# Altium project led-clock.PrjPcb
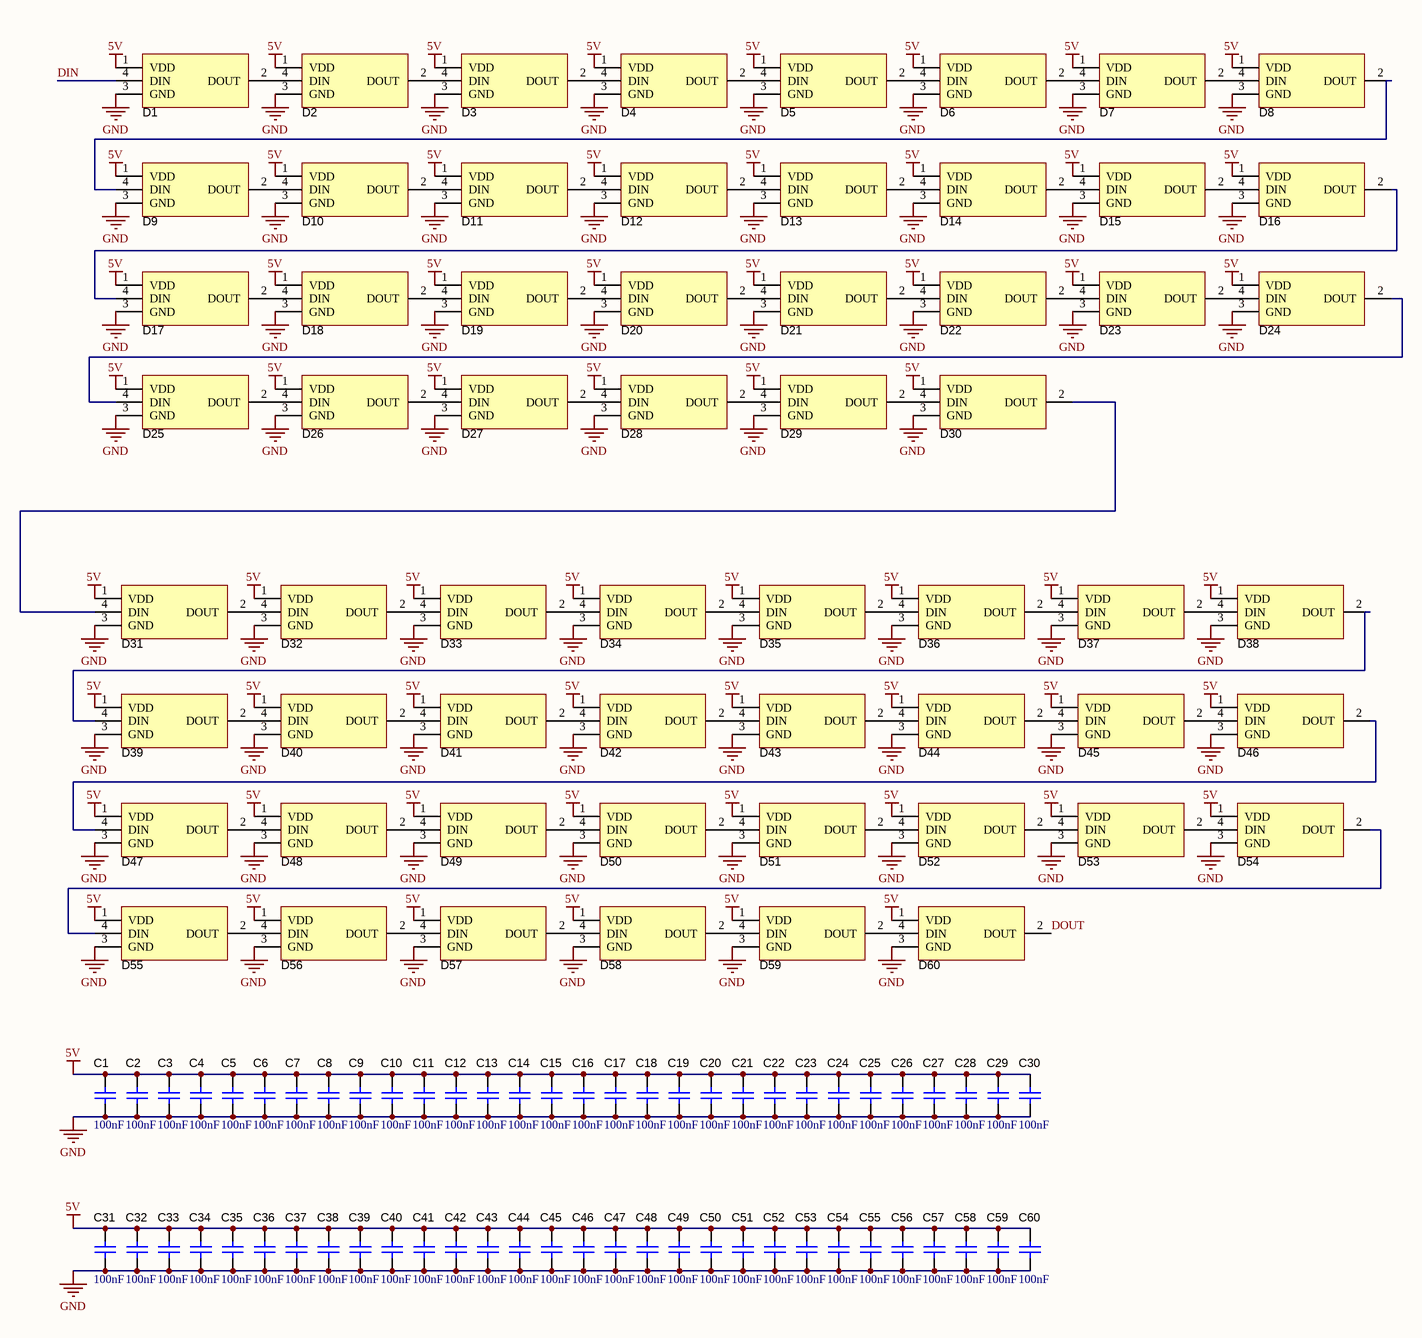
[diagram p0: schematic.SchDoc]
1 sheet, 120 parts. Net scope: global (net labels, ports and power ports of the same name join across sheets).
Board file: pcb.PcbDoc

## Sheet schematic.SchDoc
size A3; SheetNumber: 1; SheetTotal: 1

### Parts
C1  value 100nF  [capacitor 0603]  (hidden comment: passive_5)
C2  value 100nF  [capacitor 0603]  (hidden comment: passive_5)
C3  value 100nF  [capacitor 0603]  (hidden comment: passive_5)
C4  value 100nF  [capacitor 0603]  (hidden comment: passive_5)
C5  value 100nF  [capacitor 0603]  (hidden comment: passive_5)
C6  value 100nF  [capacitor 0603]  (hidden comment: passive_5)
C7  value 100nF  [capacitor 0603]  (hidden comment: passive_5)
C8  value 100nF  [capacitor 0603]  (hidden comment: passive_5)
C9  value 100nF  [capacitor 0603]  (hidden comment: passive_5)
C10  value 100nF  [capacitor 0603]  (hidden comment: passive_5)
C11  value 100nF  [capacitor 0603]  (hidden comment: passive_5)
C12  value 100nF  [capacitor 0603]  (hidden comment: passive_5)
C13  value 100nF  [capacitor 0603]  (hidden comment: passive_5)
C14  value 100nF  [capacitor 0603]  (hidden comment: passive_5)
C15  value 100nF  [capacitor 0603]  (hidden comment: passive_5)
C16  value 100nF  [capacitor 0603]  (hidden comment: passive_5)
C17  value 100nF  [capacitor 0603]  (hidden comment: passive_5)
C18  value 100nF  [capacitor 0603]  (hidden comment: passive_5)
C19  value 100nF  [capacitor 0603]  (hidden comment: passive_5)
C20  value 100nF  [capacitor 0603]  (hidden comment: passive_5)
C21  value 100nF  [capacitor 0603]  (hidden comment: passive_5)
C22  value 100nF  [capacitor 0603]  (hidden comment: passive_5)
C23  value 100nF  [capacitor 0603]  (hidden comment: passive_5)
C24  value 100nF  [capacitor 0603]  (hidden comment: passive_5)
C25  value 100nF  [capacitor 0603]  (hidden comment: passive_5)
C26  value 100nF  [capacitor 0603]  (hidden comment: passive_5)
C27  value 100nF  [capacitor 0603]  (hidden comment: passive_5)
C28  value 100nF  [capacitor 0603]  (hidden comment: passive_5)
C29  value 100nF  [capacitor 0603]  (hidden comment: passive_5)
C30  value 100nF  [capacitor 0603]  (hidden comment: passive_5)
C31  value 100nF  [capacitor 0603]  (hidden comment: passive_5)
C32  value 100nF  [capacitor 0603]  (hidden comment: passive_5)
C33  value 100nF  [capacitor 0603]  (hidden comment: passive_5)
C34  value 100nF  [capacitor 0603]  (hidden comment: passive_5)
C35  value 100nF  [capacitor 0603]  (hidden comment: passive_5)
C36  value 100nF  [capacitor 0603]  (hidden comment: passive_5)
C37  value 100nF  [capacitor 0603]  (hidden comment: passive_5)
C38  value 100nF  [capacitor 0603]  (hidden comment: passive_5)
C39  value 100nF  [capacitor 0603]  (hidden comment: passive_5)
C40  value 100nF  [capacitor 0603]  (hidden comment: passive_5)
C41  value 100nF  [capacitor 0603]  (hidden comment: passive_5)
C42  value 100nF  [capacitor 0603]  (hidden comment: passive_5)
C43  value 100nF  [capacitor 0603]  (hidden comment: passive_5)
C44  value 100nF  [capacitor 0603]  (hidden comment: passive_5)
C45  value 100nF  [capacitor 0603]  (hidden comment: passive_5)
C46  value 100nF  [capacitor 0603]  (hidden comment: passive_5)
C47  value 100nF  [capacitor 0603]  (hidden comment: passive_5)
C48  value 100nF  [capacitor 0603]  (hidden comment: passive_5)
C49  value 100nF  [capacitor 0603]  (hidden comment: passive_5)
C50  value 100nF  [capacitor 0603]  (hidden comment: passive_5)
C51  value 100nF  [capacitor 0603]  (hidden comment: passive_5)
C52  value 100nF  [capacitor 0603]  (hidden comment: passive_5)
C53  value 100nF  [capacitor 0603]  (hidden comment: passive_5)
C54  value 100nF  [capacitor 0603]  (hidden comment: passive_5)
C55  value 100nF  [capacitor 0603]  (hidden comment: passive_5)
C56  value 100nF  [capacitor 0603]  (hidden comment: passive_5)
C57  value 100nF  [capacitor 0603]  (hidden comment: passive_5)
C58  value 100nF  [capacitor 0603]  (hidden comment: passive_5)
C59  value 100nF  [capacitor 0603]  (hidden comment: passive_5)
C60  value 100nF  [capacitor 0603]  (hidden comment: passive_5)
D1  diode_8  [SK6812-E]  (value not drawn)
D2  diode_8  [SK6812-E]  (value not drawn)
D3  diode_8  [SK6812-E]  (value not drawn)
D4  diode_8  [SK6812-E]  (value not drawn)
D5  diode_8  [SK6812-E]  (value not drawn)
D6  diode_8  [SK6812-E]  (value not drawn)
D7  diode_8  [SK6812-E]  (value not drawn)
D8  diode_8  [SK6812-E]  (value not drawn)
D9  diode_8  [SK6812-E]  (value not drawn)
D10  diode_8  [SK6812-E]  (value not drawn)
D11  diode_8  [SK6812-E]  (value not drawn)
D12  diode_8  [SK6812-E]  (value not drawn)
D13  diode_8  [SK6812-E]  (value not drawn)
D14  diode_8  [SK6812-E]  (value not drawn)
D15  diode_8  [SK6812-E]  (value not drawn)
D16  diode_8  [SK6812-E]  (value not drawn)
D17  diode_8  [SK6812-E]  (value not drawn)
D18  diode_8  [SK6812-E]  (value not drawn)
D19  diode_8  [SK6812-E]  (value not drawn)
D20  diode_8  [SK6812-E]  (value not drawn)
D21  diode_8  [SK6812-E]  (value not drawn)
D22  diode_8  [SK6812-E]  (value not drawn)
D23  diode_8  [SK6812-E]  (value not drawn)
D24  diode_8  [SK6812-E]  (value not drawn)
D25  diode_8  [SK6812-E]  (value not drawn)
D26  diode_8  [SK6812-E]  (value not drawn)
D27  diode_8  [SK6812-E]  (value not drawn)
D28  diode_8  [SK6812-E]  (value not drawn)
D29  diode_8  [SK6812-E]  (value not drawn)
D30  diode_8  [SK6812-E]  (value not drawn)
D31  diode_8  [SK6812-E]  (value not drawn)
D32  diode_8  [SK6812-E]  (value not drawn)
D33  diode_8  [SK6812-E]  (value not drawn)
D34  diode_8  [SK6812-E]  (value not drawn)
D35  diode_8  [SK6812-E]  (value not drawn)
D36  diode_8  [SK6812-E]  (value not drawn)
D37  diode_8  [SK6812-E]  (value not drawn)
D38  diode_8  [SK6812-E]  (value not drawn)
D39  diode_8  [SK6812-E]  (value not drawn)
D40  diode_8  [SK6812-E]  (value not drawn)
D41  diode_8  [SK6812-E]  (value not drawn)
D42  diode_8  [SK6812-E]  (value not drawn)
D43  diode_8  [SK6812-E]  (value not drawn)
D44  diode_8  [SK6812-E]  (value not drawn)
D45  diode_8  [SK6812-E]  (value not drawn)
D46  diode_8  [SK6812-E]  (value not drawn)
D47  diode_8  [SK6812-E]  (value not drawn)
D48  diode_8  [SK6812-E]  (value not drawn)
D49  diode_8  [SK6812-E]  (value not drawn)
D50  diode_8  [SK6812-E]  (value not drawn)
D51  diode_8  [SK6812-E]  (value not drawn)
D52  diode_8  [SK6812-E]  (value not drawn)
D53  diode_8  [SK6812-E]  (value not drawn)
D54  diode_8  [SK6812-E]  (value not drawn)
D55  diode_8  [SK6812-E]  (value not drawn)
D56  diode_8  [SK6812-E]  (value not drawn)
D57  diode_8  [SK6812-E]  (value not drawn)
D58  diode_8  [SK6812-E]  (value not drawn)
D59  diode_8  [SK6812-E]  (value not drawn)
D60  diode_8  [SK6812-E]  (value not drawn)

### Nets
5V: C1.2 C2.2 C3.2 C4.2 C5.2 C6.2 C7.2 C8.2 C9.2 C10.2 C11.2 C12.2 C13.2 C14.2 C15.2 C16.2 C17.2 C18.2 C19.2 C20.2 C21.2 C22.2 C23.2 C24.2 C25.2 C26.2 C27.2 C28.2 C29.2 C30.2 C31.2 C32.2 C33.2 C34.2 C35.2 C36.2 C37.2 C38.2 C39.2 C40.2 C41.2 C42.2 C43.2 C44.2 C45.2 C46.2 C47.2 C48.2 C49.2 C50.2 C51.2 C52.2 C53.2 C54.2 C55.2 C56.2 C57.2 C58.2 C59.2 C60.2 D1.1(VDD) D2.1(VDD) D3.1(VDD) D4.1(VDD) D5.1(VDD) D6.1(VDD) D7.1(VDD) D8.1(VDD) D9.1(VDD) D10.1(VDD) D11.1(VDD) D12.1(VDD) D13.1(VDD) D14.1(VDD) D15.1(VDD) D16.1(VDD) D17.1(VDD) D18.1(VDD) D19.1(VDD) D20.1(VDD) D21.1(VDD) D22.1(VDD) D23.1(VDD) D24.1(VDD) D25.1(VDD) D26.1(VDD) D27.1(VDD) D28.1(VDD) D29.1(VDD) D30.1(VDD) D31.1(VDD) D32.1(VDD) D33.1(VDD) D34.1(VDD) D35.1(VDD) D36.1(VDD) D37.1(VDD) D38.1(VDD) D39.1(VDD) D40.1(VDD) D41.1(VDD) D42.1(VDD) D43.1(VDD) D44.1(VDD) D45.1(VDD) D46.1(VDD) D47.1(VDD) D48.1(VDD) D49.1(VDD) D50.1(VDD) D51.1(VDD) D52.1(VDD) D53.1(VDD) D54.1(VDD) D55.1(VDD) D56.1(VDD) D57.1(VDD) D58.1(VDD) D59.1(VDD) D60.1(VDD)
GND: C1.1 C2.1 C3.1 C4.1 C5.1 C6.1 C7.1 C8.1 C9.1 C10.1 C11.1 C12.1 C13.1 C14.1 C15.1 C16.1 C17.1 C18.1 C19.1 C20.1 C21.1 C22.1 C23.1 C24.1 C25.1 C26.1 C27.1 C28.1 C29.1 C30.1 C31.1 C32.1 C33.1 C34.1 C35.1 C36.1 C37.1 C38.1 C39.1 C40.1 C41.1 C42.1 C43.1 C44.1 C45.1 C46.1 C47.1 C48.1 C49.1 C50.1 C51.1 C52.1 C53.1 C54.1 C55.1 C56.1 C57.1 C58.1 C59.1 C60.1 D1.3(GND) D2.3(GND) D3.3(GND) D4.3(GND) D5.3(GND) D6.3(GND) D7.3(GND) D8.3(GND) D9.3(GND) D10.3(GND) D11.3(GND) D12.3(GND) D13.3(GND) D14.3(GND) D15.3(GND) D16.3(GND) D17.3(GND) D18.3(GND) D19.3(GND) D20.3(GND) D21.3(GND) D22.3(GND) D23.3(GND) D24.3(GND) D25.3(GND) D26.3(GND) D27.3(GND) D28.3(GND) D29.3(GND) D30.3(GND) D31.3(GND) D32.3(GND) D33.3(GND) D34.3(GND) D35.3(GND) D36.3(GND) D37.3(GND) D38.3(GND) D39.3(GND) D40.3(GND) D41.3(GND) D42.3(GND) D43.3(GND) D44.3(GND) D45.3(GND) D46.3(GND) D47.3(GND) D48.3(GND) D49.3(GND) D50.3(GND) D51.3(GND) D52.3(GND) D53.3(GND) D54.3(GND) D55.3(GND) D56.3(GND) D57.3(GND) D58.3(GND) D59.3(GND) D60.3(GND)
DIN: D1.4(DIN)
DOUT: D60.2(DOUT)
NetD1_2: D1.2(DOUT) D2.4(DIN)
NetD2_2: D2.2(DOUT) D3.4(DIN)
NetD3_2: D3.2(DOUT) D4.4(DIN)
NetD4_2: D4.2(DOUT) D5.4(DIN)
NetD5_2: D5.2(DOUT) D6.4(DIN)
NetD6_2: D6.2(DOUT) D7.4(DIN)
NetD7_2: D7.2(DOUT) D8.4(DIN)
NetD8_2: D8.2(DOUT) D9.4(DIN)
NetD9_2: D9.2(DOUT) D10.4(DIN)
NetD10_2: D10.2(DOUT) D11.4(DIN)
NetD11_2: D11.2(DOUT) D12.4(DIN)
NetD12_2: D12.2(DOUT) D13.4(DIN)
NetD13_2: D13.2(DOUT) D14.4(DIN)
NetD14_2: D14.2(DOUT) D15.4(DIN)
NetD15_2: D15.2(DOUT) D16.4(DIN)
NetD16_2: D16.2(DOUT) D17.4(DIN)
NetD17_2: D17.2(DOUT) D18.4(DIN)
NetD18_2: D18.2(DOUT) D19.4(DIN)
NetD19_2: D19.2(DOUT) D20.4(DIN)
NetD20_2: D20.2(DOUT) D21.4(DIN)
NetD21_2: D21.2(DOUT) D22.4(DIN)
NetD22_2: D22.2(DOUT) D23.4(DIN)
NetD23_2: D23.2(DOUT) D24.4(DIN)
NetD24_2: D24.2(DOUT) D25.4(DIN)
NetD25_2: D25.2(DOUT) D26.4(DIN)
NetD26_2: D26.2(DOUT) D27.4(DIN)
NetD27_2: D27.2(DOUT) D28.4(DIN)
NetD28_2: D28.2(DOUT) D29.4(DIN)
NetD29_2: D29.2(DOUT) D30.4(DIN)
NetD30_2: D30.2(DOUT) D31.4(DIN)
NetD31_2: D31.2(DOUT) D32.4(DIN)
NetD32_2: D32.2(DOUT) D33.4(DIN)
NetD33_2: D33.2(DOUT) D34.4(DIN)
NetD34_2: D34.2(DOUT) D35.4(DIN)
NetD35_2: D35.2(DOUT) D36.4(DIN)
NetD36_2: D36.2(DOUT) D37.4(DIN)
NetD37_2: D37.2(DOUT) D38.4(DIN)
NetD38_2: D38.2(DOUT) D39.4(DIN)
NetD39_2: D39.2(DOUT) D40.4(DIN)
NetD40_2: D40.2(DOUT) D41.4(DIN)
NetD41_2: D41.2(DOUT) D42.4(DIN)
NetD42_2: D42.2(DOUT) D43.4(DIN)
NetD43_2: D43.2(DOUT) D44.4(DIN)
NetD44_2: D44.2(DOUT) D45.4(DIN)
NetD45_2: D45.2(DOUT) D46.4(DIN)
NetD46_2: D46.2(DOUT) D47.4(DIN)
NetD47_2: D47.2(DOUT) D48.4(DIN)
NetD48_2: D48.2(DOUT) D49.4(DIN)
NetD49_2: D49.2(DOUT) D50.4(DIN)
NetD50_2: D50.2(DOUT) D51.4(DIN)
NetD51_2: D51.2(DOUT) D52.4(DIN)
NetD52_2: D52.2(DOUT) D53.4(DIN)
NetD53_2: D53.2(DOUT) D54.4(DIN)
NetD54_2: D54.2(DOUT) D55.4(DIN)
NetD55_2: D55.2(DOUT) D56.4(DIN)
NetD56_2: D56.2(DOUT) D57.4(DIN)
NetD57_2: D57.2(DOUT) D58.4(DIN)
NetD58_2: D58.2(DOUT) D59.4(DIN)
NetD59_2: D59.2(DOUT) D60.4(DIN)

### Library data of the parts
C1-C60 = passive_5: Capacitor 0603
D1-D60 = diode_8: SK6812-E